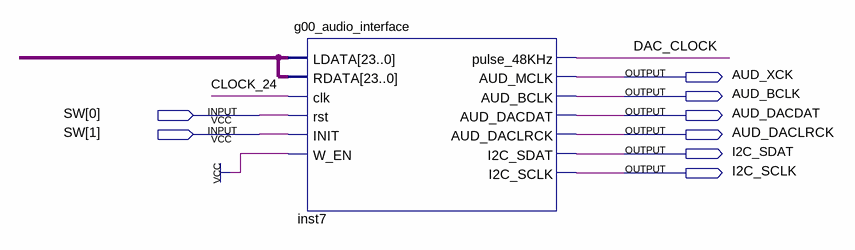
[diagram p0: schematic sheet]
// Quartus schematic audio_out.bdf as structural Verilog: 1 symbols, 8 pins
module audio_out (
  input  [1:0] SW,
  output AUD_XCK,
  output AUD_BCLK,
  output AUD_DACDAT,
  output AUD_DACLRCK,
  output I2C_SDAT,
  output I2C_SCLK
);

  wire CLOCK_24, DAC_CLOCK;
  wire [23:0] undriven;

  g00_audio_interface inst7 (
    .LDATA(undriven), .RDATA(undriven), .clk(CLOCK_24), .rst(SW[0]), .INIT(SW[1]), .W_EN(1'b1),
    .pulse_48KHz(DAC_CLOCK), .AUD_MCLK(AUD_XCK), .AUD_BCLK(AUD_BCLK), .AUD_DACDAT(AUD_DACDAT),
    .AUD_DACLRCK(AUD_DACLRCK), .I2C_SDAT(I2C_SDAT), .I2C_SCLK(I2C_SCLK));
endmodule
